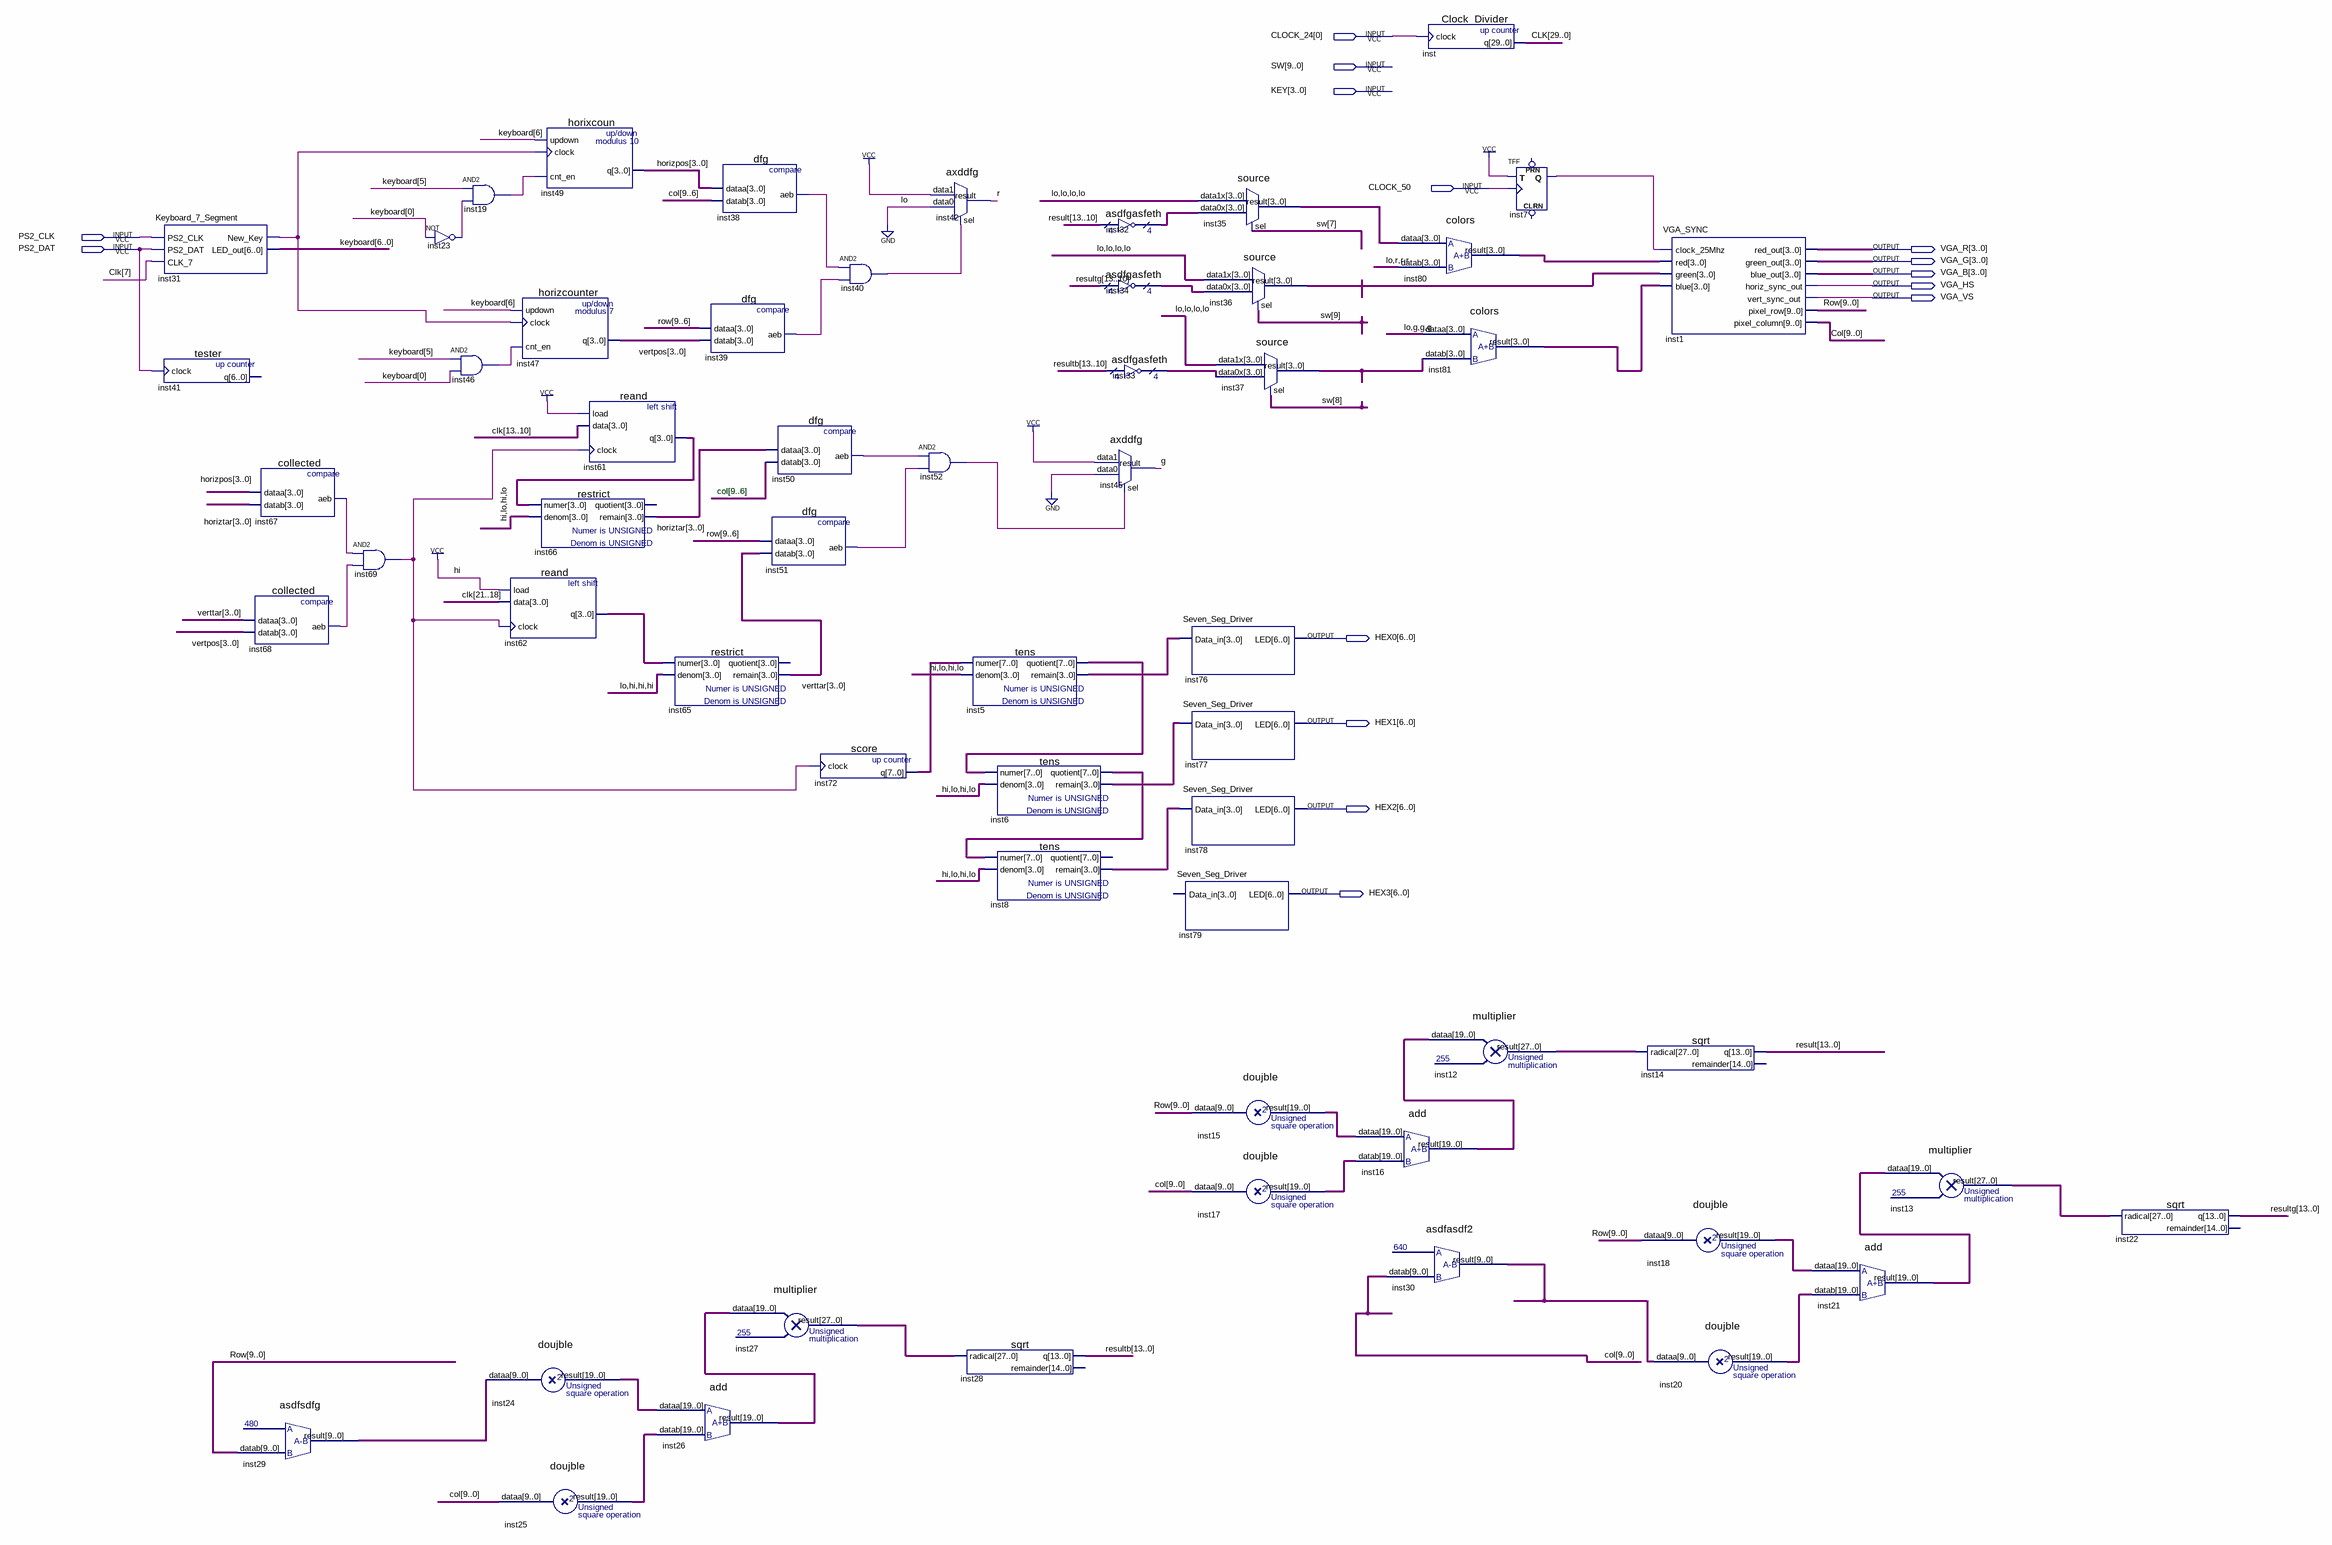
[diagram p0: schematic sheet]
// Quartus schematic LAB8.bdf as structural Verilog: 58 symbols, 15 pins
module LAB8 (
  input  [0:0] CLOCK_24,
  input  [9:0] SW,
  input  [3:0] KEY,
  input  CLOCK_50,
  input  PS2_CLK,
  input  PS2_DAT,
  output [3:0] VGA_R,
  output [3:0] VGA_G,
  output [3:0] VGA_B,
  output VGA_HS,
  output VGA_VS,
  output [6:0] HEX0,
  output [6:0] HEX1,
  output [6:0] HEX2,
  output [6:0] HEX3
);

  wire g, inst7_q, inst19_out, inst23_out, inst31_new_key, inst38_aeb, inst39_aeb, inst40_out, inst46_out,
       inst50_aeb, inst51_aeb, inst52_out, inst67_aeb, inst68_aeb, inst69_out, r;
  wire [3:0] horizpos, horiztar, inst5_remain, inst6_remain, inst8_remain, inst32_result, inst33_result,
       inst34_result, inst35_result, inst36_result, inst37_result, inst61_q, inst62_q, inst80_result,
       inst81_result, vertpos, verttar;
  wire [6:0] keyboard;
  wire [7:0] inst5_quotient, inst6_quotient, inst72_q;
  wire [9:0] Col, inst29_result, inst30_result, Row;
  wire [13:0] result, resultb, resultg;
  wire [19:0] inst15_result, inst16_result, inst17_result, inst18_result, inst20_result, inst21_result,
       inst24_result, inst25_result, inst26_result;
  wire [27:0] inst12_result, inst13_result, inst27_result;
  wire [29:0] Clk;

  Keyboard_7_Segment inst31 (
    .PS2_CLK(PS2_CLK), .PS2_DAT(PS2_DAT), .CLK_7(Clk[7]), .New_Key(inst31_new_key), .LED_out(keyboard));
  tester inst41 (.clock(PS2_DAT));  // open: q
  collected inst68 (.dataa(verttar), .datab(vertpos), .aeb(inst68_aeb));
  asdfsdfg inst29 (.datab(Row), .result(inst29_result));
  collected inst67 (.dataa(horizpos), .datab(horiztar), .aeb(inst67_aeb));
  and inst69 (inst69_out, inst67_aeb, inst68_aeb);
  not inst23 (inst23_out, keyboard[0]);
  and inst19 (inst19_out, keyboard[5], inst23_out);
  and inst46 (inst46_out, keyboard[5], keyboard[0]);
  doujble inst24 (.dataa(inst29_result), .result(inst24_result));
  horixcoun inst49 (.updown(keyboard[6]), .clock(inst31_new_key), .cnt_en(inst19_out), .q(horizpos));
  horizcounter inst47 (.updown(keyboard[6]), .clock(inst31_new_key), .cnt_en(inst46_out), .q(vertpos));
  \restrict  inst66 (.numer(inst61_q), .denom(4'b1010), .remain(horiztar));  // open: quotient
  reand inst62 (.load(1'b1), .data(Clk[21:18]), .clock(inst69_out), .q(inst62_q));
  doujble inst25 (.dataa(Col), .result(inst25_result));
  reand inst61 (.load(1'b1), .data(Clk[13:10]), .clock(inst69_out), .q(inst61_q));
  \restrict  inst65 (.numer(inst62_q), .denom(4'b0111), .remain(verttar));  // open: quotient
  add inst26 (.dataa(inst24_result), .datab(inst25_result), .result(inst26_result));
  dfg inst38 (.dataa(horizpos), .datab(Col[9:6]), .aeb(inst38_aeb));
  dfg inst39 (.dataa(Row[9:6]), .datab(vertpos), .aeb(inst39_aeb));
  multiplier inst27 (.dataa(inst26_result), .result(inst27_result));
  dfg inst50 (.dataa(horiztar), .datab(Col[9:6]), .aeb(inst50_aeb));
  dfg inst51 (.dataa(Row[9:6]), .datab(verttar), .aeb(inst51_aeb));
  score inst72 (.clock(inst69_out), .q(inst72_q));
  and inst40 (inst40_out, inst38_aeb, inst39_aeb);
  and inst52 (inst52_out, inst50_aeb, inst51_aeb);
  axddfg inst42 (.data1(1'b1), .data0(1'b0), .sel(inst40_out), .result(r));
  tens inst5 (.numer(inst72_q), .denom(4'b1010), .quotient(inst5_quotient), .remain(inst5_remain));
  sqrt inst28 (.radical(inst27_result), .q(resultb));  // open: remainder
  tens inst6 (.numer(inst5_quotient), .denom(4'b1010), .quotient(inst6_quotient), .remain(inst6_remain));
  tens inst8 (.numer(inst6_quotient), .denom(4'b1010), .remain(inst8_remain));  // open: quotient
  asdfgasfeth inst32 (.data(result[13:10]), .result(inst32_result));
  asdfgasfeth inst34 (.data(resultg[13:10]), .result(inst34_result));
  asdfgasfeth inst33 (.data(resultb[13:10]), .result(inst33_result));
  axddfg inst45 (.data1(1'b1), .data0(1'b0), .sel(inst52_out), .result(g));
  source inst35 (.data1x(4'b0000), .data0x(inst32_result), .sel(SW[7]), .result(inst35_result));
  source inst36 (.data1x(4'b0000), .data0x(inst34_result), .sel(SW[9]), .result(inst36_result));
  source inst37 (.data1x(4'b0000), .data0x(inst33_result), .sel(SW[8]), .result(inst37_result));
  Seven_Seg_Driver inst76 (.Data_in(inst5_remain), .LED(HEX0));
  Seven_Seg_Driver inst77 (.Data_in(inst6_remain), .LED(HEX1));
  Seven_Seg_Driver inst78 (.Data_in(inst8_remain), .LED(HEX2));
  Seven_Seg_Driver inst79 (.LED(HEX3));  // open: Data_in
  doujble inst15 (.dataa(Row), .result(inst15_result));
  doujble inst17 (.dataa(Col), .result(inst17_result));
  add inst16 (.dataa(inst15_result), .datab(inst17_result), .result(inst16_result));
  colors inst80 (.dataa(inst35_result), .datab({1'b0, {3{r}}}), .result(inst80_result));
  asdfasdf2 inst30 (.datab(Col), .result(inst30_result));
  Clock_Divider inst (.clock(CLOCK_24[0]), .q(Clk));
  colors inst81 (.dataa({1'b0, {3{g}}}), .datab(inst37_result), .result(inst81_result));
  multiplier inst12 (.dataa(inst16_result), .result(inst12_result));
  TFF inst7 (.T(1'b1), .CLK(CLOCK_50), .Q(inst7_q));  // open: PRN, CLRN
  sqrt inst14 (.radical(inst12_result), .q(result));  // open: remainder
  doujble inst18 (.dataa(Row), .result(inst18_result));
  doujble inst20 (.dataa(inst30_result), .result(inst20_result));
  VGA_SYNC inst1 (
    .clock_25Mhz(inst7_q), .red(inst80_result), .green(inst36_result), .blue(inst81_result), .red_out(VGA_R),
    .green_out(VGA_G), .blue_out(VGA_B), .horiz_sync_out(VGA_HS), .vert_sync_out(VGA_VS), .pixel_row(Row),
    .pixel_column(Col));
  add inst21 (.dataa(inst18_result), .datab(inst20_result), .result(inst21_result));
  multiplier inst13 (.dataa(inst21_result), .result(inst13_result));
  sqrt inst22 (.radical(inst13_result), .q(resultg));  // open: remainder

  // Notes on the sheet:
  //   col[9..6]
endmodule
